# Altium schematic sheet 环境检查.SchDoc
size A4
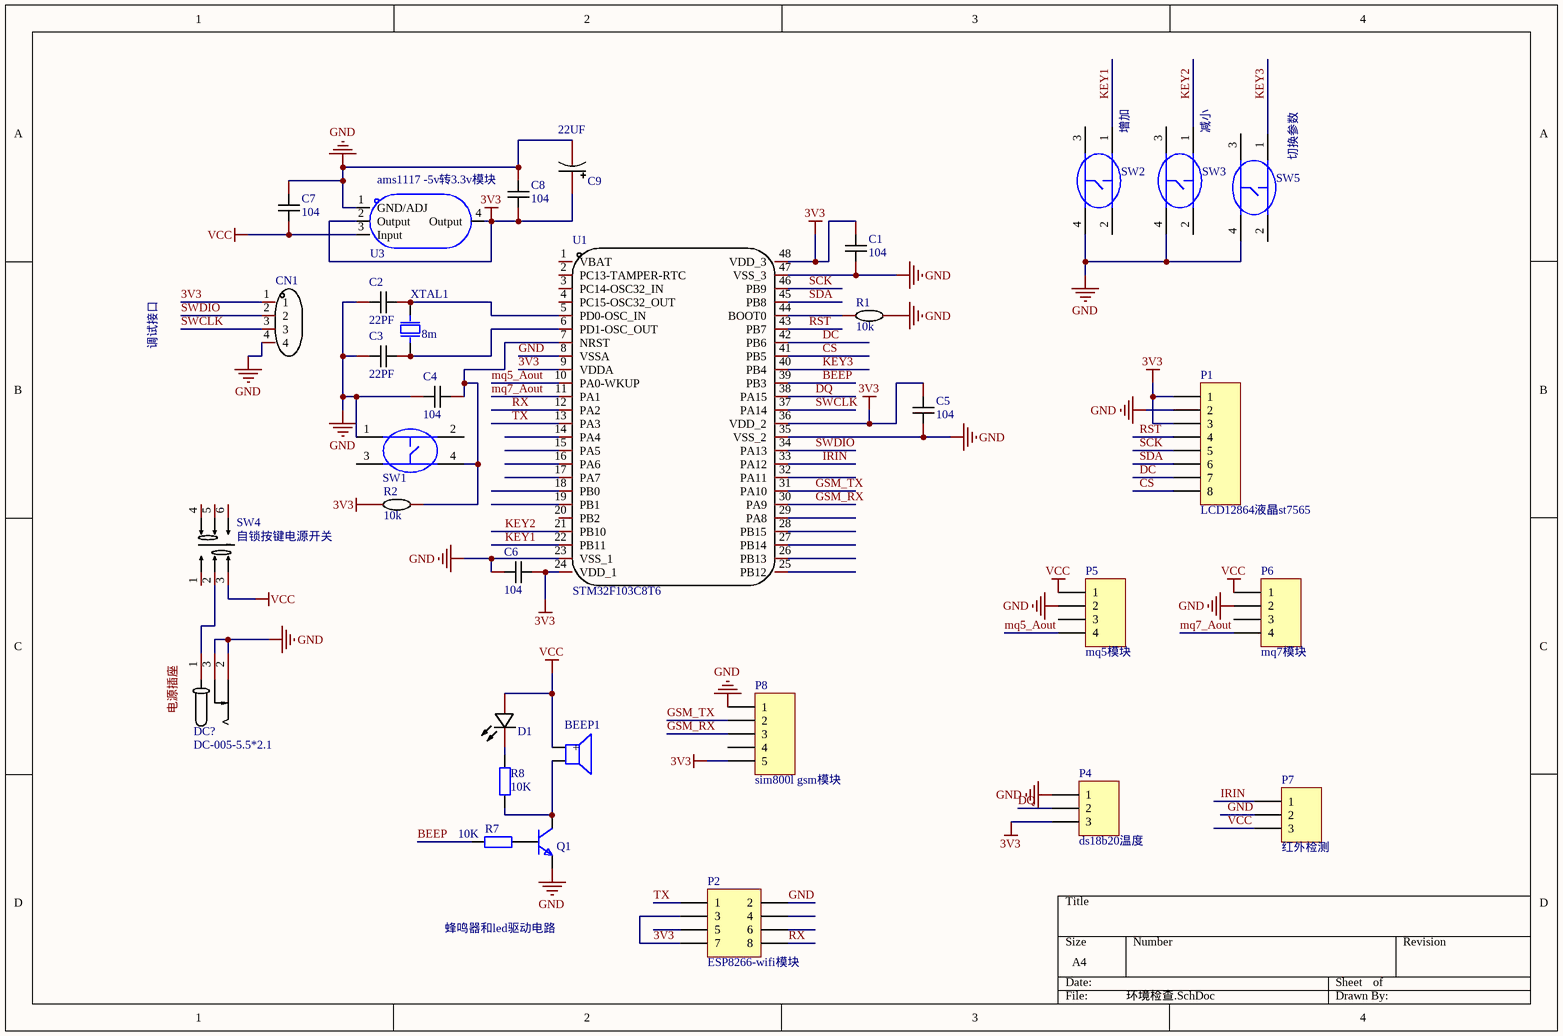
[diagram p0: 环境检查.SchDoc]

## Parts
BEEP1  蜂鸣器p7.6  [BUZ-TH_BD12.0-P7.60-D0.6-FD]  (value not drawn)
C1  104  [C0603]
C2  22PF  [C0603]
C3  22PF  [C0603]
C4  104  [C0603]
C5  104  [C0603]
C6  104  [C0603]
C7  104  [C0603]
C8  104  [C0603]
C9  22UF  [CAP-SMD_BD4.0-L4.3-W4.3-FD]
CN1  HX25035-4A  [CONN-TH_4P-P2.50_HX25035-4A]  (value not drawn)
D1  LED-0603W-FZ-WHITE  [LED0603-RD_WHITE]  (value not drawn)
DC?  DC-005-5.5*2.1  [DC-IN-TH_DC005]
P1  LCD12864液晶st7565  [HDR1X8]
P2  ESP8266-wifi模块  [HDR2X4]
P4  ds18b20温度  [HDR1X3]
P5  mq5模块  [HDR1X4]
P6  mq7模块  [HDR1X4]
P7  红外检测  [HDR1X3]
P8  sim800l gsm模块  [HDR1X5]
Q1  S8050  [SOT-23-3_L2.9-W1.6-P1.90-LS2.8-BR]  (value not drawn)
R1  10k  [R0603]
R2  10k  [R0603]
R7  value 10K  [AXIAL-0.4]  (hidden comment: Res2)
R8  value 10K  [AXIAL-0.4]  (hidden comment: Res2)
SW1  6x6开关  [KEY-TH_4P-L6.0-W6.0-P4.50-LS6.5]  (value not drawn)
SW2  6x6开关  [KEY-TH_4P-L6.0-W6.0-P4.50-LS6.5]  (value not drawn)
SW3  6x6开关  [KEY-TH_4P-L6.0-W6.0-P4.50-LS6.5]  (value not drawn)
SW4  自锁按键电源开关  [SW-TH_6P-L8.5-W8.5-P2.54-LS5.5]
SW5  6x6开关  [KEY-TH_4P-L6.0-W6.0-P4.50-LS6.5]  (value not drawn)
U1  STM32F103C8T6  [LQFP-48_L7.0-W7.0-P0.50-LS9.0-BL]
U3  AMS1117-3.3  [SOT-223-4_L6.5-W3.5-P2.30-LS7.0-BR]  (value not drawn)
XTAL1  8m  [HC-49S_L11.4-W4.8]

## Nets
3V3: C1.2 C5.2 C6.2 C8.1 C9.1 CN1.1 P1.1 P1.3 P2.3 P2.7 P4.3 P8.5 R2.1 U1.9(VDDA) U1.24(VDD_1) U1.36(VDD_2) U1.48(VDD_3) U3.2(Output) U3.4(Output)
GND: C1.1 C2.1 C3.1 C4.1 C5.1 C6.1 C7.2 C8.2 C9.2 CN1.4 DC?.2 DC?.3 P1.2 P2.2 P4.1 P5.2 P6.2 P7.2 P8.1 Q1.2(E) R1.2 SW1.1 SW2.4 SW3.4 SW5.4 U1.8(VSSA) U1.23(VSS_1) U1.35(VSS_2) U1.47(VSS_3) U3.1(GND/ADJ)
VCC: BEEP1.1(+) C7.1 D1.2(A) P5.1 P6.1 P7.3 SW4.3 U3.3(Input)
BEEP: R7.1 U1.39(PB3)
CS: P1.8 U1.41(PB5)
DC: P1.7 U1.42(PB6)
DQ: P4.2 U1.38(PA15)
GSM_RX: P8.3 U1.30(PA9)
GSM_TX: P8.2 U1.31(PA10)
IRIN: P7.1 U1.33(PA12)
KEY1: SW2.1 U1.22(PB11)
KEY2: SW3.1 U1.21(PB10)
KEY3: SW5.1 U1.40(PB4)
mq5_Aout: P5.4 U1.10(PA0-WKUP)
mq7_Aout: P6.4 U1.11(PA1)
RST: P1.4 U1.43(PB7)
RX: P2.8 U1.12(PA2)
SCK: P1.5 U1.46(PB9)
SDA: P1.6 U1.45(PB8)
SWCLK: CN1.3 U1.37(PA14)
SWDIO: CN1.2 U1.34(PA13)
TX: P2.1 U1.13(PA3)
NetBEEP1_2: BEEP1.2 Q1.3(C) R8.1
NetC2_2: C2.2 U1.5(PD0-OSC_IN) XTAL1.1(OSC1)
NetC3_2: C3.2 U1.6(PD1-OSC_OUT) XTAL1.2(OSC2)
NetC4_2: C4.2 R2.2 SW1.4 U1.7(NRST)
NetD1_1: D1.1(K) R8.2
NetDC?_1: DC?.1 SW4.2
NetQ1_1: Q1.1(B) R7.2
NetR1_1: R1.1 U1.44(BOOT0)

Not connected (* = marked no-connect by the designer): P2 4 5 6; P5 3; P6 3; P8 4; SW1 2 3; SW2 2 3; SW3 2 3; SW4 1 4 5 6; SW5 2 3; U1 1(VBAT) 2(PC13-TAMPER-RTC) 3(PC14-OSC32_IN) 4(PC15-OSC32_OUT) 14(PA4) 15(PA5) 16(PA6) 17(PA7) 18(PB0) 19(PB1) 20(PB2) 25(PB12) 26(PB13) 27(PB14) 28(PB15) 29(PA8) 32(PA11)

## Notes on the sheet
- (near SW2) 增加
- (near SW3) 减小
- (near SW5) 切换参数
- ams1117 -5v转3.3v模块
- 调试接口
- 蜂鸣器和led驱动电路
- Labels drawn without touching a wire or pin: 电源插座

## Library data of the parts
C1-C8 = C0603
C9 = 铝电解电容: 容值:4.7uF;精度:±20%;额定电压:50V;电容体直径:4mm;电容体长度:5.4mm;纹波电流:-;等效串联电阻:-;工作寿命:1000hrs@85℃;工作温度:-40℃~+85℃;; Manufacturer: PANASONIC(松下); Symbol: EEE1HA4R7WR; Add into BOM: yes; Value: 4.7uF; Tolerance: ±20%; Rated Voltage: 50V; φD: 4mm; L: 5.4mm; Device: EEE1HA4R7WR; LCSC Part Name: 4.7uF ±20% 50V; Supplier Part: C336278; Manufacturer Part: EEE1HA4R7WR; Supplier Footprint: SMD,D4xL5.4mm; JLCPCB Part Class: 扩展库; Datasheet: https://atta.szlcsc.com/upload/public/pdf/source/20190108/C336278_0910F05714807C8E9D56A0ADC4387579.pdf; Supplier: LCSC; Convert to PCB: yes; Ripple Current: -; Equivalent Series Resistance(ESR): -; Lifetime @ Temp: 1000hrs@85℃; Operating Temperature: -40℃~+85℃
CN1 = HX25035-4A: 参考系列:-;间距:2.5mm;插针结构:1x4P;排数:1;每排PIN数:4;行距:-;公母:公型插针;安装方式:直插;额定电流:-;工作温度范围:-;; Manufacturer: HX(红星); Add into BOM: yes; Pitch: 2.5mm; Pins Structure: 1x4P; Number of PINs Per Row: 4; Gender: 公型插针; NAME: 1; Name: HX25035-4A; Symbol: HX25035-4A; Device: HX25035-4A; LCSC Part Name: 母座 直插/直针 2.5mm 4Pin位 母座; Supplier Part: C442380; Manufacturer Part: HX25035-4A; Supplier Footprint: 插件,P=2.5mm; JLCPCB Part Class: 扩展库; Datasheet: https://atta.szlcsc.com/upload/public/pdf/source/20191028/C442380_E4175C0CE7217DA3EBE8A84780194668.pdf; Supplier: LCSC; Convert to PCB: yes; Reference Series: -; Number of Rows: 1; Row Spacing: -; Mounting Style: 直插; Current Rating (Max): -; Operating Temperature Range: -; NUMBER: 1
D1 = led0603: Add into BOM: yes; Symbol: LED-0603W-FZ-WHITE; Device: LED-0603W-FZ-WHITE; LCSC Part Name: LED-0603W-FZ-WHITE; Supplier Part: C9900007572; Manufacturer Part: LED-0603W-FZ-WHITE; Supplier Footprint: LED0603; JLCPCB Part Class: 扩展库; Datasheet: 2022-02-15/306503D/d15aff8c982b42f0a71dfd9798705d3a/D-060306W4／SS2／B4规格书.pdf; Supplier: LCSC; Convert to PCB: yes
P1 = Header 8: Header, 8-Pin; LatestRevisionDate: 17-Jul-2002; LatestRevisionNote: Re-released for DXP Platform.; Publisher: Altium Limited
P2 = Header 4X2: Header, 4-Pin, Dual row; LatestRevisionDate: 17-Jul-2002; LatestRevisionNote: Re-released for DXP Platform.; Publisher: Altium Limited
P4 P7 = Header 3: Header, 3-Pin; LatestRevisionDate: 17-Jul-2002; LatestRevisionNote: Re-released for DXP Platform.; Publisher: Altium Limited
P5 P6 = Header 4: Header, 4-Pin; LatestRevisionDate: 17-Jul-2002; LatestRevisionNote: Re-released for DXP Platform.; Publisher: Altium Limited
P8 = Header 5: Header, 5-Pin; LatestRevisionDate: 17-Jul-2002; LatestRevisionNote: Re-released for DXP Platform.; Publisher: Altium Limited
Q1 = S8050: Manufacturer: Doeshare(德芯); Symbol: S8050_C2931719; Add into BOM: yes; Device: S8050; LCSC Part Name: NPN 25V 500mA 120-400 SOT-23; Supplier Part: C2931719; Manufacturer Part: S8050; Supplier Footprint: SOT-23; Datasheet: https://atta.szlcsc.com/upload/public/pdf/source/20220117/E6D3315E0D6ADDB25840BFFAC039C5C0.pdf; Supplier: LCSC; Convert to PCB: yes
R1 R2 = R0603
R7 R8 = Res2: Resistor; Published: 8-Jun-2000; LatestRevisionDate: 17-Jul-2002; LatestRevisionNote: Re-released for DXP Platform.; PackageReference: AXIAL-0.4; Publisher: Altium Limited; PackageDescription: Axial Device, Thru-Hole; 2 Leads; 0.4 in Pin Spacing
SW1-SW3 SW5 = 6x6开关: Manufacturer: 韩国韩荣; Symbol: K2-1102DP-C4SW-04; Add into BOM: yes; Contact Current: 50mA; Voltage Rating (DC): 12V; Insulation Resistance: 100MΩ; Circuit: 单刀单掷; Actuator Style: 圆形按钮; Operating Force: 250gf@±30gf; Mechanical Life: 100000; Switch Length: 6mm; Switch Height: 5mm; Device: K2-1102DP-C4SW-04; LCSC Part Name: 轻触按键开关6*6*5; Supplier Part: C110153; Manufacturer Part: K2-1102DP-C4SW-04; Supplier Footprint: 插件; JLCPCB Part Class: Extended Part; Datasheet: https://atta.szlcsc.com/upload/public/pdf/source/20210810/D0CD9D77408EACA829A5E533AC6E5B1E.pdf; Supplier: LCSC; Convert to PCB: yes; Mounting Style: 直插; With Lamp: -; Operating Temperature: -25~+85; Switch Width: 6mm
SW4 = 自锁按键
U1 = APM32F103C8T6: CPU内核:ARM Cortex-M3;CPU最大主频:72MHz;工作电压范围:2V~3.6V;内部振荡器:有;外部时钟频率范围:4MHz~16MHz;程序 FLASH容量:64KB;RAM总容量:20KB;EEPROM/数据 FLASH容量:-;GPIO端口数量:37;ADC(单元数/通道数/位数):2@x10ch/12bit;DAC(单元数/通道数/位数):-;(E)PWM(单元数/通道数/位数):1@x6ch/16bit;8位Timer数量:-;16位Timer数量:3;32位Timer数量:-;; Manufacturer: Geehy(珠海极海); Add into BOM: yes; Maximum Frequency: 72MHz; Internal Oscillator: 有; Program FLASH Size: 64KB; RAM Size: 20KB; GPIO Ports Number: 37; 16Bit Timer Number: 3; I2C Number: 2; CAN Number: 1; USB (H/D/OTG): 全速USB Device; Peripherals / Functions / Protocol Stacks: 低电压检测；看门狗；CCP捕获/比较；LIN总线协议；片载温度传感器；IrDA；CRC校验；DMA；RTC实时时钟; NAME: VDD_3; NUMBER: 48; Symbol: APM32F103C8T6; Device: APM32F103C8T6; LCSC Part Name: APM32F103C8T6; Supplier Part: C393540; Manufacturer Part: APM32F103C8T6; Supplier Footprint: LQFP-48; JLCPCB Part Class: 扩展库; Datasheet: https://atta.szlcsc.com/upload/public/pdf/source/20190521/C393540_FFB71F29E309C6AA8307E3596601FB14.pdf; Supplier: LCSC; Convert to PCB: yes; CPU Core: ARM Cortex-M3; Supply Voltage Range: 2V~3.6V; External Clock Frequency Rang: 4MHz~16MHz; EEPROM/Data FLASH Size: -; ADC (Units/Channels/bits): 2@x10ch/12bit; DAC (Units/Channels/bits): -; (E)PWM (Units/Channels/bits): 1@x6ch/16bit; 8Bit Timer Number: -; 32Bit Timer Number: -; CMP Number: -; U(S)ART Number: 3; I2S Number: -; (Q)SPI Number: 3; Operating Temperature Range: -40℃~+85℃; Name: APM32F103C8T6
U3 = AMS1117-3.3: Manufacturer: KEXIN(科信); Symbol: AMS1117-3.3_C369933; Add into BOM: yes; Output Type: 固定; Output Polarity: 正; Number of Outputs: 1; Maximum Input Voltage: 18V; Output Voltage: 3.3V; Dropout Voltage: 1.3V@800mA; Quiescent Current (Ground Current): 8mA; Output Current: 1A; Device: AMS1117-3.3; LCSC Part Name: Vin=18V Vout=3.3V 1A; Supplier Part: C369933; Manufacturer Part: AMS1117-3.3; Supplier Footprint: SOT-223; JLCPCB Part Class: Extended Part; Datasheet: https://atta.szlcsc.com/upload/public/pdf/source/20190724/C369933_94137CB0CFA8D6ABD8E5DA714A2C2C4B.pdf; Supplier: LCSC; Convert to PCB: yes; Power Supply Rejection Ratio (PRSS): -; Noise: -; Feature: -; Operating Temperature: -
XTAL1 = 贴片晶振X49SM